# EAGLE design Secondary (EAGLE 5.12)

## Sheet 1 of 3
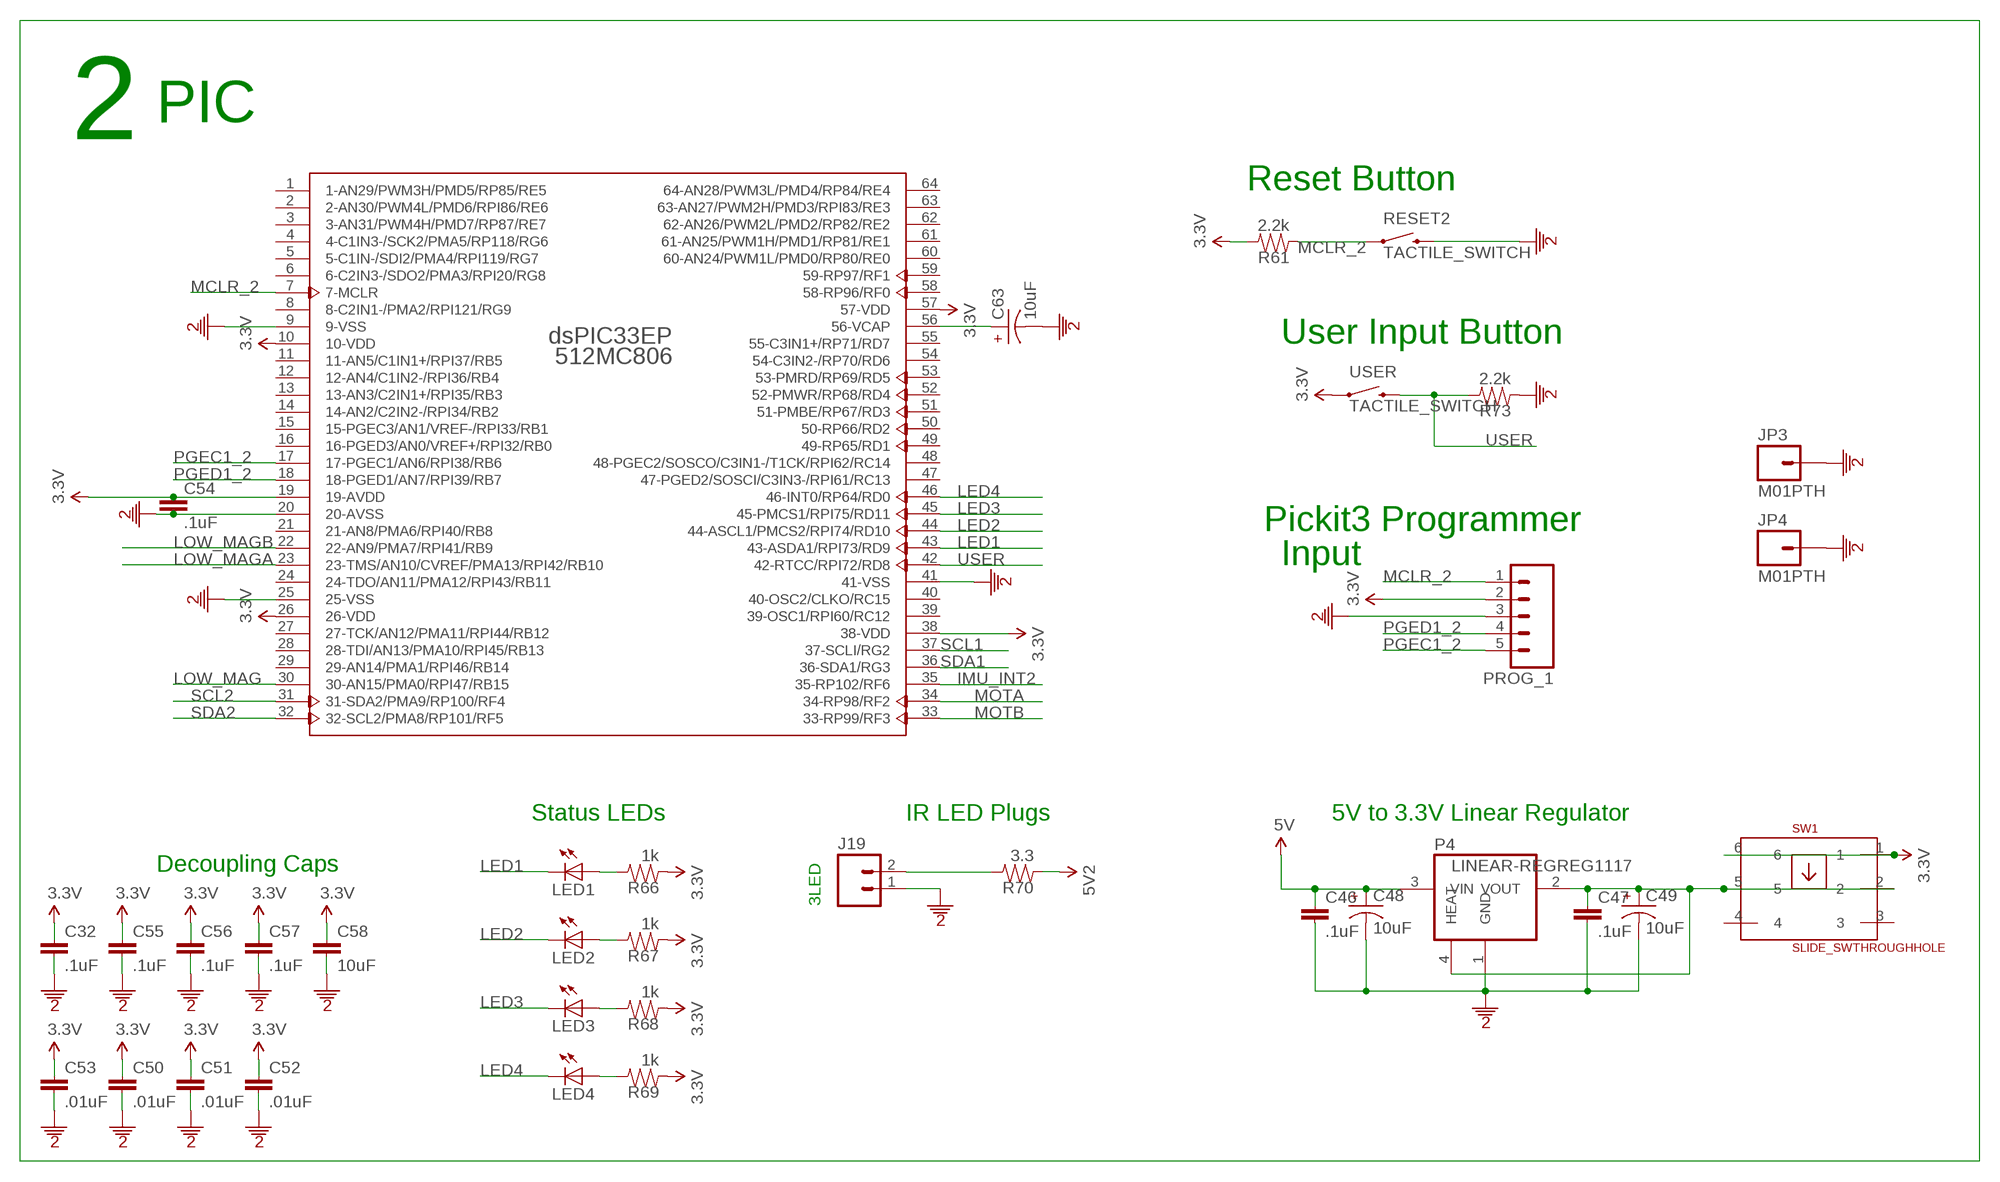
[diagram p0: schematic, sheet 1]

### Parts
C32  .1uF  CAP0603  [0603]
C46  .1uF  CAP1206  [1206]
C47  .1uF  CAP1206  [1206]
C48  10uF  CAP-POL0603  [0603-POL]
C49  10uF  CAP-POL0603  [0603-POL]
C50  .01uF  CAP0603  [0603]
C51  .01uF  CAP0603  [0603]
C52  .01uF  CAP0603  [0603]
C53  .01uF  CAP0603  [0603]
C54  .1uF  CAP0603  [0603]
C55  .1uF  CAP0603  [0603]
C56  .1uF  CAP0603  [0603]
C57  .1uF  CAP0603  [0603]
C58  10uF  CAP1206  [1206]
C63  10uF  CAP-POL0603  [0603-POL]
J19  M02JST-SH  [JST-SH-2]
JP3  M01PTH  [1X01]
JP4  M01PTH  [1X01]
LED1  LED5MM  [LED5MM]
LED2  LED5MM  [LED5MM]
LED3  LED5MM  [LED5MM]
LED4  LED5MM  [LED5MM]
P4  LINEAR-REGREG1117  LINEAR-REG1117  [SOT223]
PIC2  DSPIC33EP512MC806  [TQFP64_10X10]
PROG_1  M05PTH  [1X05]
R61  2.2k  R0603  [0603]
R66  1k  R0603  [0603]
R67  1k  R0603  [0603]
R68  1k  R0603  [0603]
R69  1k  R0603  [0603]
R70  3.3  R0603  [0603]
R73  2.2k  R0603  [0603]
RESET2  TACTILE_SWITCH  [TACTILE_SWITCH]
SW1  SLIDE_SWTHROUGHHOLE  [SLIDE_SWITCH]
USER  TACTILE_SWITCH  [TACTILE_SWITCH]

### Nets
3.3V: C32.1 C50.1 C51.1 C52.1 C53.1 C54.1 C55.1 C56.1 C57.1 C58.1 PIC2.10(10-VDD) PIC2.19(19-AVDD) PIC2.26(26-VDD) PIC2.38(38-VDD) PIC2.57(57-VDD) PROG_1.2 R61.2 R66.1 R67.1 R68.1 R69.1 SW1.1 SW1.6 USER.1 ; also sheet 2
5V2: C46.1 C48.+ P4.3(VIN) R70.1 ; supply symbol labelled 5V ; also sheet 2,3
GND2: C32.2 C46.2 C47.2 C48.- C49.- C50.2 C51.2 C52.2 C53.2 C54.2 C55.2 C56.2 C57.2 C58.2 C63.- J19.1 JP3.1 JP4.1 P4.1(GND) PIC2.9(9-VSS) PIC2.20(20-AVSS) PIC2.25(25-VSS) PIC2.41(41-VSS) PROG_1.3 R73.1 RESET2.2 ; also sheet 2,3
IMU_INT2: PIC2.35(35-RP102/RF6) ; also sheet 2
LED1: LED1.K(C) PIC2.43(43-ASDA1/RPI73/RD9)
LED2: LED2.K(C) PIC2.44(44-ASCL1/PMCS2/RPI74/RD10)
LED3: LED3.K(C) PIC2.45(45-PMCS1/RPI75/RD11)
LED4: LED4.K(C) PIC2.46(46-INT0/RP64/RD0)
LOW_MAG: PIC2.30(30-AN15/PMA0/RPI47/RB15) ; also sheet 2
LOW_MAGA: PIC2.23(23-TMS/AN10/CVREF/PMA13/RPI42/RB10) ; also sheet 2
LOW_MAGB: PIC2.22(22-AN9/PMA7/RPI41/RB9) ; also sheet 2
MCLR_2: PIC2.7(7-MCLR) PROG_1.1 R61.1 RESET2.1
MOTA: PIC2.34(34-RP98/RF2) ; also sheet 2
MOTB: PIC2.33(33-RP99/RF3) ; also sheet 2
N$104: C63.+ PIC2.56(56-VCAP)
N$108: LED1.A R66.2
N$109: LED2.A R67.2
N$110: LED3.A R68.2
N$111: LED4.A R69.2
N$112: J19.2 R70.2
PGEC1_2: PIC2.17(17-PGEC1/AN6/RPI38/RB6) PROG_1.5
PGED1_2: PIC2.18(18-PGED1/AN7/RPI39/RB7) PROG_1.4
PRE3.3: C47.1 C49.+ P4.2(VOUT) P4.4(HEAT) SW1.2 SW1.5 ; also sheet 2
SCL1: PIC2.37(37-SCLI/RG2) ; also sheet 2
SCL2: PIC2.31(31-SDA2/PMA9/RP100/RF4) ; also sheet 2
SDA1: PIC2.36(36-SDA1/RG3) ; also sheet 2
SDA2: PIC2.32(32-SCL2/PMA8/RP101/RF5) ; also sheet 2
USER: PIC2.42(42-RTCC/RPI72/RD8) R73.2 USER.2
Unconnected: PIC2.1(1-AN29/PWM3H/PMD5/RP85/RE5) PIC2.2(2-AN30/PWM4L/PMD6/RPI86/RE6) PIC2.3(3-AN31/PWM4H/PMD7/RP87/RE7) PIC2.4(4-C1IN3-/SCK2/PMA5/RP118/RG6) PIC2.5(5-C1IN-/SDI2/PMA4/RPI119/RG7) PIC2.6(6-C2IN3-/SDO2/PMA3/RPI20/RG8) PIC2.8(8-C2IN1-/PMA2/RPI121/RG9) PIC2.11(11-AN5/C1IN1+/RPI37/RB5) PIC2.12(12-AN4/C1IN2-/RPI36/RB4) PIC2.13(13-AN3/C2IN1+/RPI35/RB3) PIC2.14(14-AN2/C2IN2-/RPI34/RB2) PIC2.15(15-PGEC3/AN1/VREF-/RPI33/RB1) PIC2.16(16-PGED3/AN0/VREF+/RPI32/RB0) PIC2.21(21-AN8/PMA6/RPI40/RB8) PIC2.24(24-TDO/AN11/PMA12/RPI43/RB11) PIC2.27(27-TCK/AN12/PMA11/RPI44/RB12) PIC2.28(28-TDI/AN13/PMA10/RPI45/RB13) PIC2.29(29-AN14/PMA1/RPI46/RB14) PIC2.39(39-OSC1/RPI60/RC12) PIC2.40(40-OSC2/CLKO/RC15) PIC2.47(47-PGED2/SOSCI/C3IN3-/RPI61/RC13) PIC2.48(48-PGEC2/SOSCO/C3IN1-/T1CK/RPI62/RC14) PIC2.49(49-RP65/RD1) PIC2.50(50-RP66/RD2) PIC2.51(51-PMBE/RP67/RD3) PIC2.52(52-PMWR/RP68/RD4) PIC2.53(53-PMRD/RP69/RD5) PIC2.54(54-C3IN2-/RP70/RD6) PIC2.55(55-C3IN1+/RP71/RD7) PIC2.58(58-RP96/RF0) PIC2.59(59-RP97/RF1) PIC2.60(60-AN24/PWM1L/PMD0/RP80/RE0) PIC2.61(61-AN25/PWM1H/PMD1/RP81/RE1) PIC2.62(62-AN26/PWM2L/PMD2/RP82/RE2) PIC2.63(63-AN27/PWM2H/PMD3/RPI83/RE3) PIC2.64(64-AN28/PWM3L/PMD4/RP84/RE4) SW1.3 SW1.4

### Notes on the sheet
- 2 | PIC
- Reset Button
- User Input Button
- Pickit3 Programmer
- Input
- Status LEDs | IR LED Plugs | 5V to 3.3V Linear Regulator
- Decoupling Caps
- 3LED

## Sheet 2 of 3
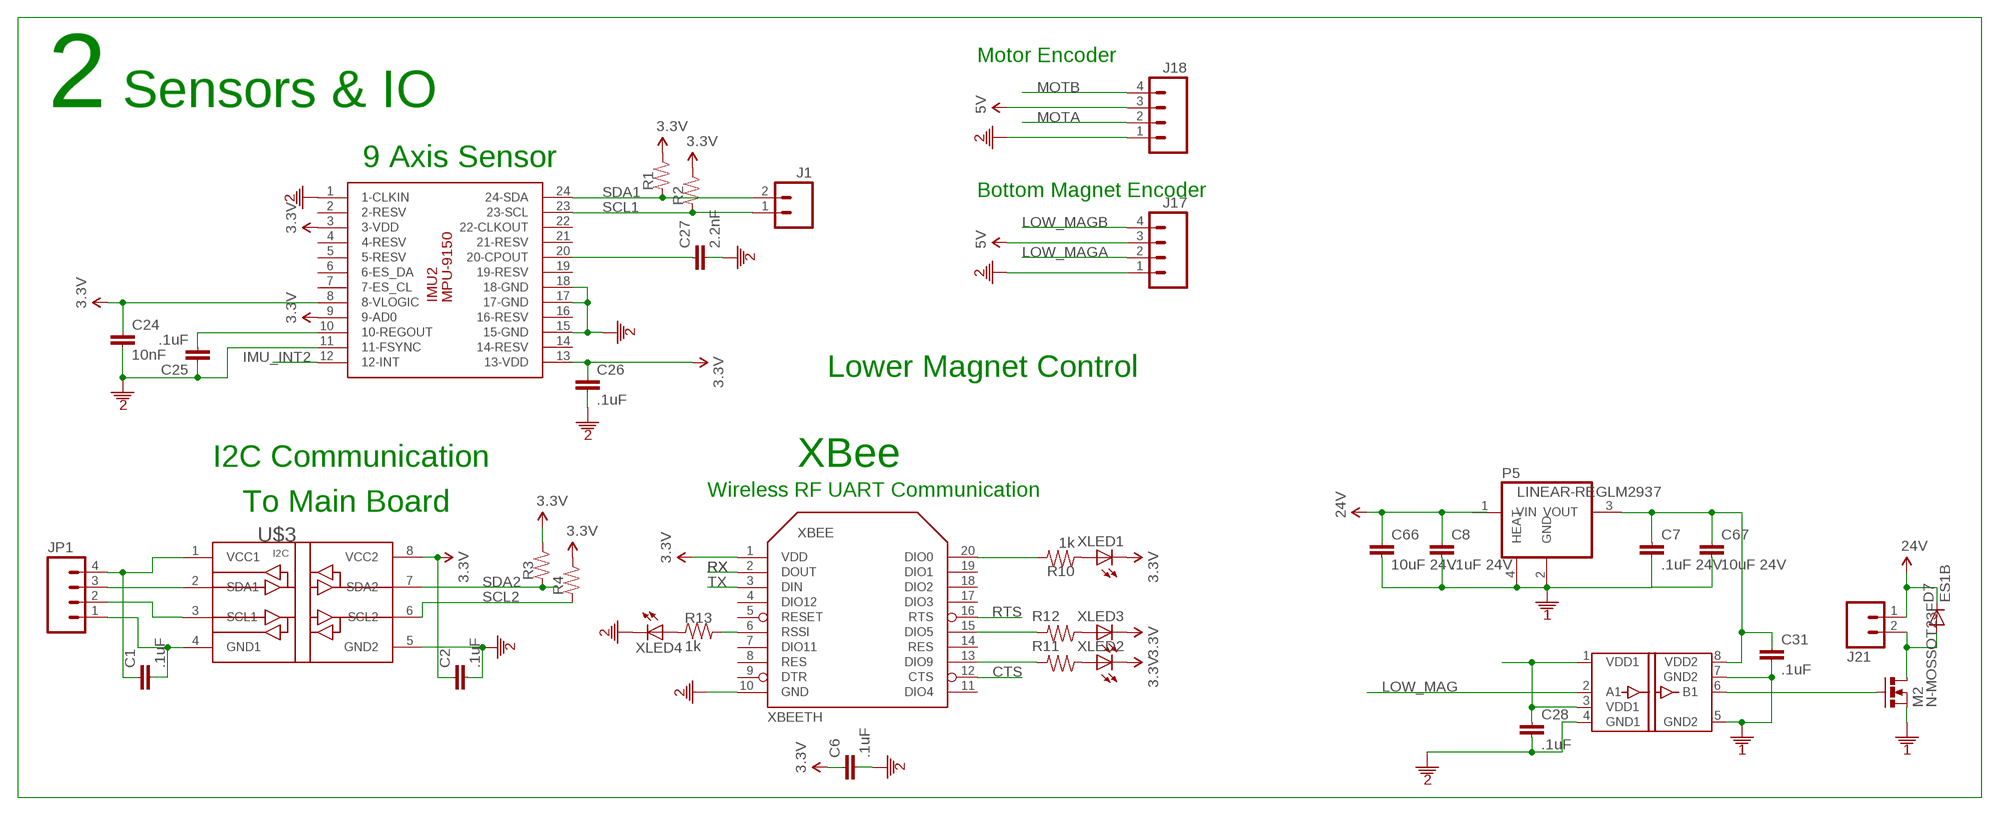
[diagram p1: schematic, sheet 2]

### Parts
C1  .1uF  CAP0603  [0603]
C2  .1uF  CAP0603  [0603]
C6  .1uF  CAP1206  [1206]
C7  .1uF 24V  CAP0603  [0603]
C8  .1uF 24V  CAP0603  [0603]
C24  10nF  CAP0603  [0603]
C25  .1uF  CAP0603  [0603]
C26  .1uF  CAP0603  [0603]
C27  2.2nF  CAP0603  [0603]
C28  .1uF  CAP0603  [0603]
C31  .1uF  CAP0603  [0603]
C66  10uF 24V  CAP1206  [1206]
C67  10uF 24V  CAP1206  [1206]
D7  ES1B  DIODESMA  [SMA-DIODE@1]
DI3  DIGITAL-ISOLATOR-1CHSOIC8-N  [SOIC8-N]
IMU2  MPU-9150  [LGA24_4X4]
J1  M02JST-PH-V  [JST-2-PH-V]
J17  M04PH-TH  [JST-4-PH-TH]
J18  M04PH-TH  [JST-4-PH-TH]
J21  M02JST-2-PH-TH  [JST-2-PH-TH]
JP1  M04PH-TH  [JST-4-PH-TH]
M2  N-MOSSOT23F  [SOT23F]
P5  LINEAR-REGLM2937  [SOT223]
R1  R0402  [0402]
R2  R0402  [0402]
R3  R0402  [0402]
R4  R0402  [0402]
R10  1k  R0603  [0603]
R11  1k  R0603  [0603]
R12  1k  R0603  [0603]
R13  1k  R0603  [0603]
U$3  ISO1540  [SOIC8]
XBEE  XBEETH  [XBEE-SILK]
XLED1  LED0603  [0603-DIODE]
XLED2  LED0603  [0603-DIODE]
XLED3  LED0603  [0603-DIODE]
XLED4  LED0603  [0603-DIODE]

### Nets
3.3V: C2.1 C6.1 C24.1 C26.1 IMU2.3(3-VDD) IMU2.8(8-VLOGIC) IMU2.9(9-AD0) IMU2.13(13-VDD) R1.2 R2.2 R3.2 R4.2 U$3.8(VCC2) XBEE.1(VDD) XLED1.CAT(C) XLED2.CAT(C) XLED3.CAT(C) ; also sheet 1
5V2: J17.3 J18.3 ; supply symbol labelled 5V ; also sheet 1,3
24V: C8.1 C66.1 D7.C J21.1 P5.1(VIN) ; also sheet 3
CTS: XBEE.12(CTS)
GND1: C7.2 C8.2 C31.2 C66.2 C67.2 DI3.5(GND2) DI3.7(GND2) M2.S P5.2(GND) P5.4(HEAT) ; also sheet 3
GND2: C2.2 C6.2 C24.2 C25.1 C26.2 C27.2 C28.2 DI3.4(GND1) IMU2.1(1-CLKIN) IMU2.11(11-FSYNC) IMU2.15(15-GND) IMU2.17(17-GND) IMU2.18(18-GND) J17.1 J18.1 U$3.5(GND2) XBEE.10(GND) XLED4.CAT(C) ; also sheet 1,3
IMU_INT2: IMU2.12(12-INT) ; also sheet 1
LOW_MAG: DI3.2(A1) ; also sheet 1
LOW_MAG_2: DI3.6(B1) M2.G
LOW_MAGA: J17.2 ; also sheet 1
LOW_MAGB: J17.4 ; also sheet 1
MOTA: J18.2 ; also sheet 1
MOTB: J18.4 ; also sheet 1
N$1: D7.A J21.2 M2.D
N$2: JP1.2 U$3.3(SCL1)
N$3: JP1.3 U$3.2(SDA1)
N$4: R11.2 XBEE.13(DIO9)
N$5: C1.1 JP1.4 U$3.1(VCC1)
N$6: C7.1 C31.1 C67.1 DI3.8(VDD2) P5.3(VOUT)
N$9: R10.2 XBEE.20(DIO0)
N$10: R10.1 XLED1.AN(A)
N$22: C27.1 IMU2.20(20-CPOUT)
N$24: C25.2 IMU2.10(10-REGOUT)
N$27: R11.1 XLED2.AN(A)
N$30: R12.2 XBEE.15(DIO5)
N$31: R12.1 XLED3.AN(A)
N$32: R13.2 XBEE.6(RSSI)
N$39: R13.1 XLED4.AN(A)
N$50: C1.2 JP1.1 U$3.4(GND1)
PRE3.3: C28.1 DI3.1(VDD1) DI3.3(VDD1) ; also sheet 1
RTS: XBEE.16(RTS)
RX: XBEE.2(DOUT)
SCL1: IMU2.23(23-SCL) J1.1 R2.1 ; also sheet 1
SCL2: R4.1 U$3.6(SCL2) ; also sheet 1
SDA1: IMU2.24(24-SDA) J1.2 R1.1 ; also sheet 1
SDA2: R3.1 U$3.7(SDA2) ; also sheet 1
TX: XBEE.3(DIN)
Unconnected: IMU2.2(2-RESV) IMU2.4(4-RESV) IMU2.5(5-RESV) IMU2.6(6-ES_DA) IMU2.7(7-ES_CL) IMU2.14(14-RESV) IMU2.16(16-RESV) IMU2.19(19-RESV) IMU2.21(21-RESV) IMU2.22(22-CLKOUT) XBEE.4(DIO12) XBEE.5(RESET) XBEE.7(DIO11) XBEE.8(RES) XBEE.9(DTR) XBEE.11(DIO4) XBEE.14(RES) XBEE.17(DIO3) XBEE.18(DIO2) XBEE.19(DIO1)

### Notes on the sheet
- Motor Encoder
- 2 | Sensors & IO
- 9 Axis Sensor
- Bottom Magnet Encoder
- Lower Magnet Control
- I2C Communication | XBee
- Wireless RF UART Communication
- To Main Board

## Sheet 3 of 3
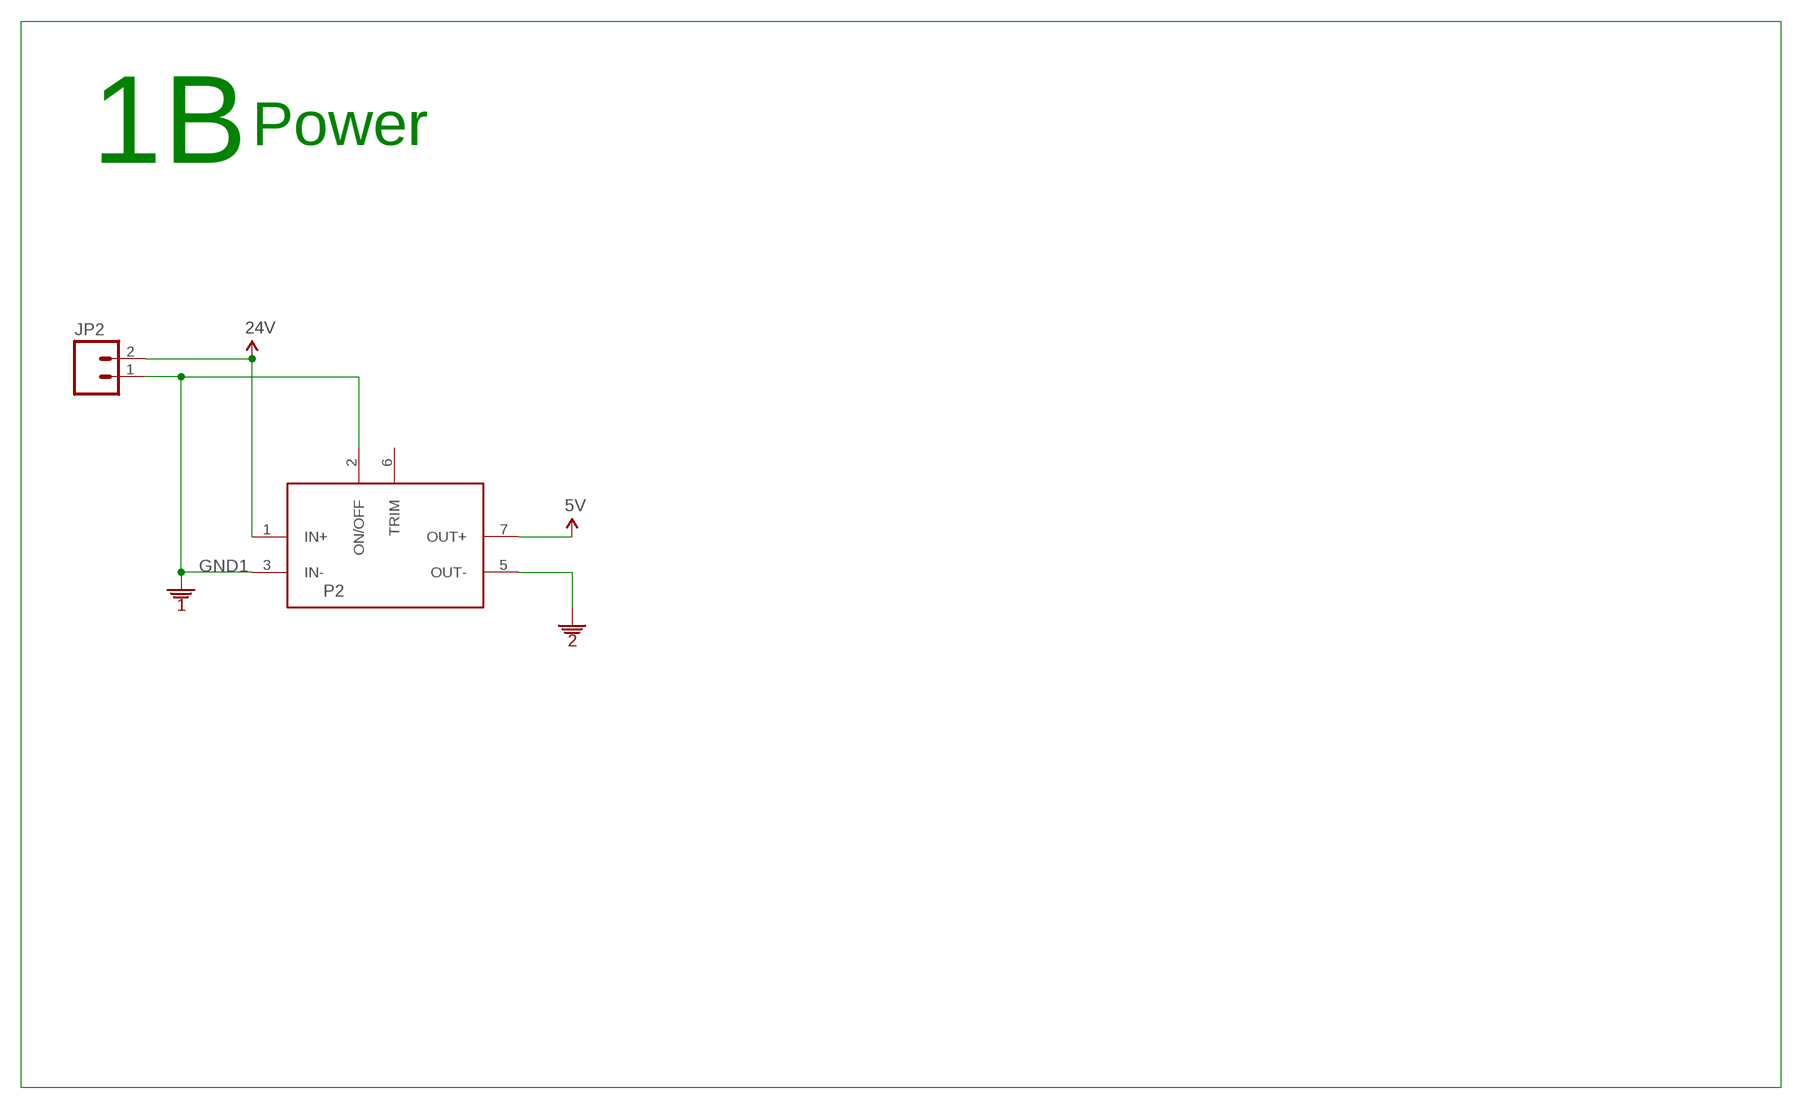
[diagram p2: schematic, sheet 3]

### Parts
JP2  M02JST-PH-TH  [JST-2-PH-TH]
P2  CC10-2405SF-E  DC-DC-CONVERTER1.2A  [CC6-2405SF-E]

### Nets
5V2: P2.7(OUT+) ; supply symbol labelled 5V ; also sheet 1,2
24V: JP2.2 P2.1(IN+) ; also sheet 2
GND1: JP2.1 P2.2(ON/OFF) P2.3(IN-) ; also sheet 2
GND2: P2.5(OUT-) ; also sheet 1,2
Unconnected: P2.6(TRIM)

### Notes on the sheet
- 1 | B | Power

## Library data of the parts
C1 C2 C7 C8 C24-C28 C31 C32 C46 C47 C50-C58 C66 C67 = Gibbot v4:CAP: Capacitor Standard 0603 ceramic capacitor, and 0.1" leaded capacitor.
C6 = GibbotV5:CAP: Capacitor Standard 0603 ceramic capacitor, and 0.1" leaded capacitor.
C48 C49 C63 = Gibbot v4:CAP-POL: CAPACITOR, American symbol
D7 = Gibbot v4:DIODE: Diode These are standard reverse protection diodes and small signal diodes. SMA package can handle up to about 1A. SOD-323 can handle about 200mA. What the SOD-323 package when ordering, there are some mfgs out there that are 5-pin packages.
DI3 = Gibbot v4:DIGITAL-ISOLATOR-1CH
IMU2 = Gibbot v4:MPU-9150
J1 JP2 = GibbotV5:M02: Header 2 Standard 2-pin 0.1" header. Use with straight break away headers (SKU : PRT-00116), right angle break away headers (PRT-00553), swiss pins (PRT-00743), machine pins (PRT-00117), and female headers (PRT-00115). Molex polarized connector foot print use with SKU : PRT-08233 with associated crimp pins and housings.
J17 = Gibbot v4:M04: Header 4 Standard 4-pin 0.1" header. Use with straight break away headers (SKU : PRT-00116), right angle break away headers (PRT-00553), swiss pins (PRT-00743), machine pins (PRT-00117), and female headers (PRT-00115). Molex polarized connector foot print use with SKU : PRT-08231 with associated crimp pins and housings. 1MM SMD Version SKU: PRT-10208
J18 JP1 = GibbotV5:M04: Header 4 Standard 4-pin 0.1" header. Use with straight break away headers (SKU : PRT-00116), right angle break away headers (PRT-00553), swiss pins (PRT-00743), machine pins (PRT-00117), and female headers (PRT-00115). Molex polarized connector foot print use with SKU : PRT-08231 with associated crimp pins and housings. 1MM SMD Version SKU: PRT-10208
J19 J21 = Gibbot v4:M02: Header 2 Standard 2-pin 0.1" header. Use with straight break away headers (SKU : PRT-00116), right angle break away headers (PRT-00553), swiss pins (PRT-00743), machine pins (PRT-00117), and female headers (PRT-00115). Molex polarized connector foot print use with SKU : PRT-08233 with associated crimp pins and housings.
JP3 JP4 = GibbotV5:M01: Header 1 Standard 1-pin 0.1" header. Use with straight break away headers (SKU : PRT-00116), right angle break away headers (PRT-00553), swiss pins (PRT-00743), machine pins (PRT-00117), and female headers (PRT-00115).
LED1-LED4 XLED1-XLED4 = GibbotV5:LED: LEDs Standard schematic elements and footprints for 5mm, 3mm, 1206, and 0603 sized LEDs. 5mm - Spark Fun Electronics SKU : COM-00529 (and others)
M2 = Gibbot v4:N-MOS
P2 = GibbotV5:DC-DC-CONVERTER
P4 P5 = Gibbot v4:LINEAR-REG
PIC2 = Gibbot v4:DSPIC33EP512MC806
PROG_1 = Gibbot v4:M05: Header 5 Standard 5-pin 0.1" header. Use with straight break away headers (SKU : PRT-00116), right angle break away headers (PRT-00553), swiss pins (PRT-00743), machine pins (PRT-00117), and female headers (PRT-00115). Molex polarized connector foot print use with SKU : PRT-08230 with associated crimp pins and housings.
R1-R4 R10-R13 = GibbotV5:R: RESISTOR, American symbol
R61 R66-R70 R73 = Gibbot v4:R: RESISTOR, American symbol
RESET2 USER = Gibbot v4:TACTILE_SWITCH
SW1 = Gibbot:SLIDE_SW
U$3 = GibbotV5:ISO1540
XBEE = GibbotV5:XBEE

## Board
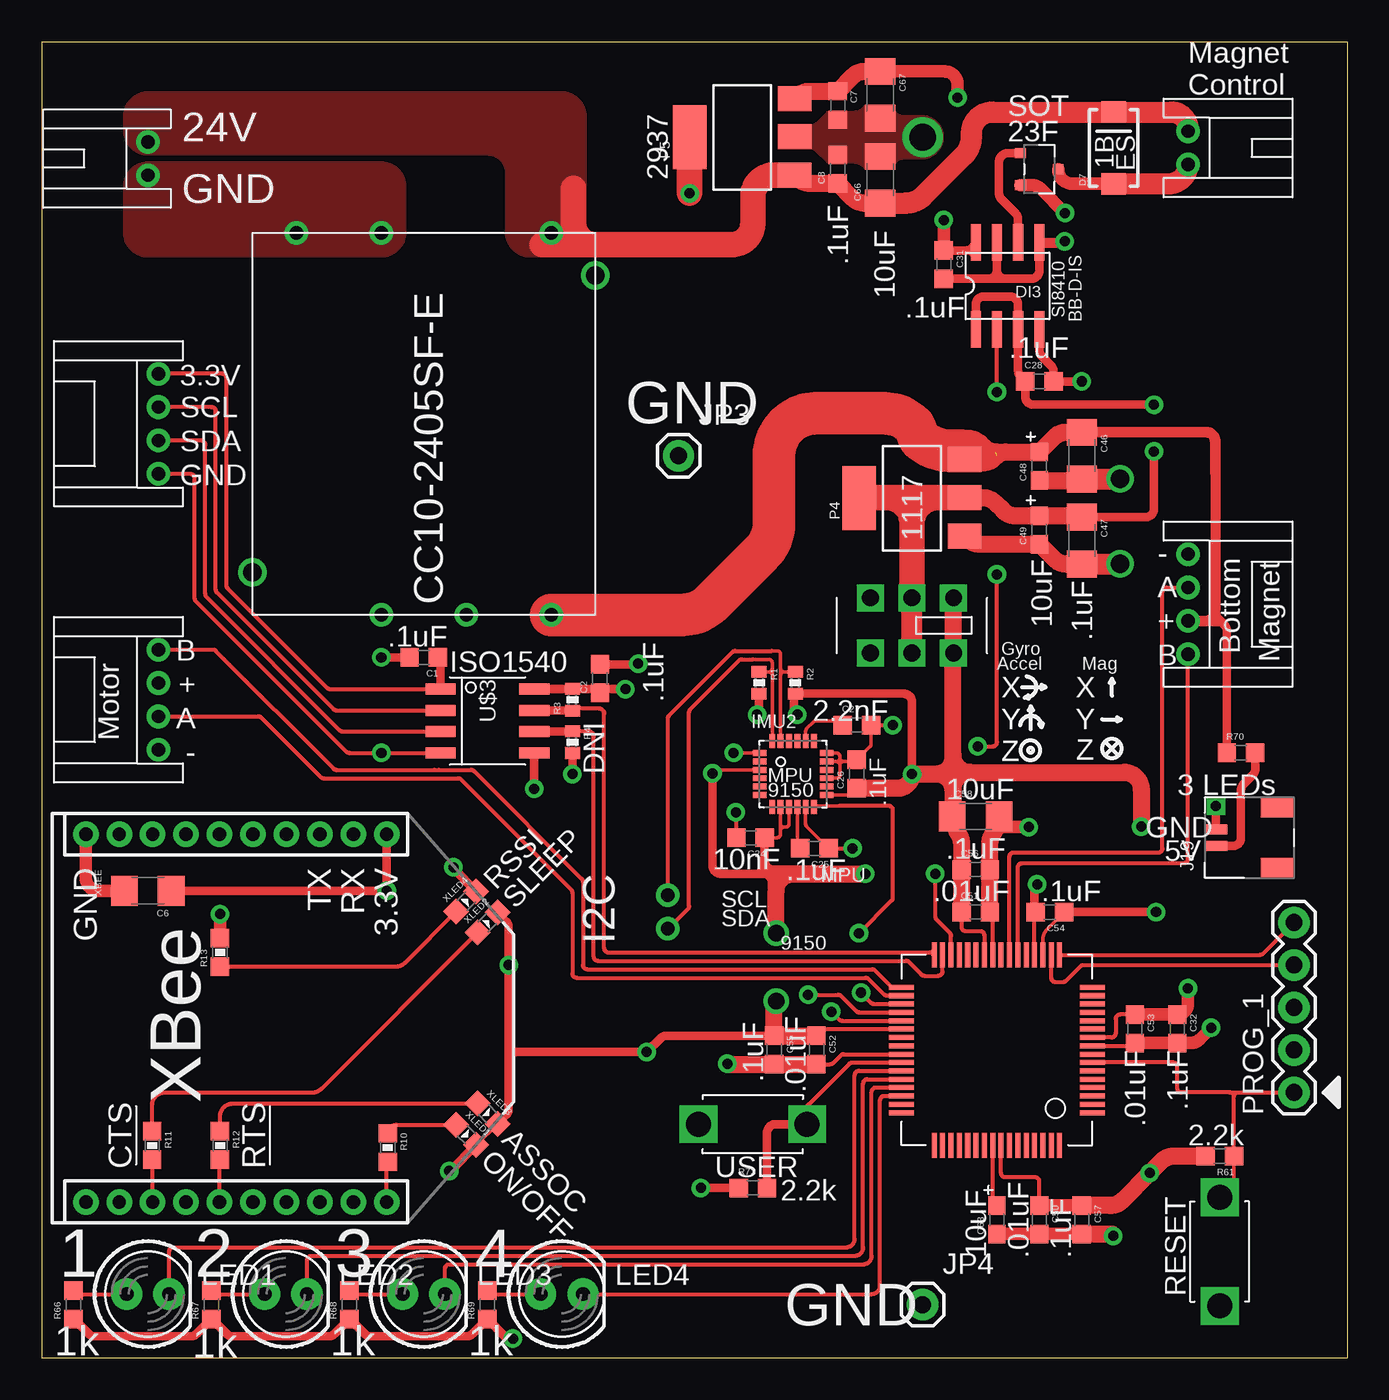
[diagram p3: board, top side]
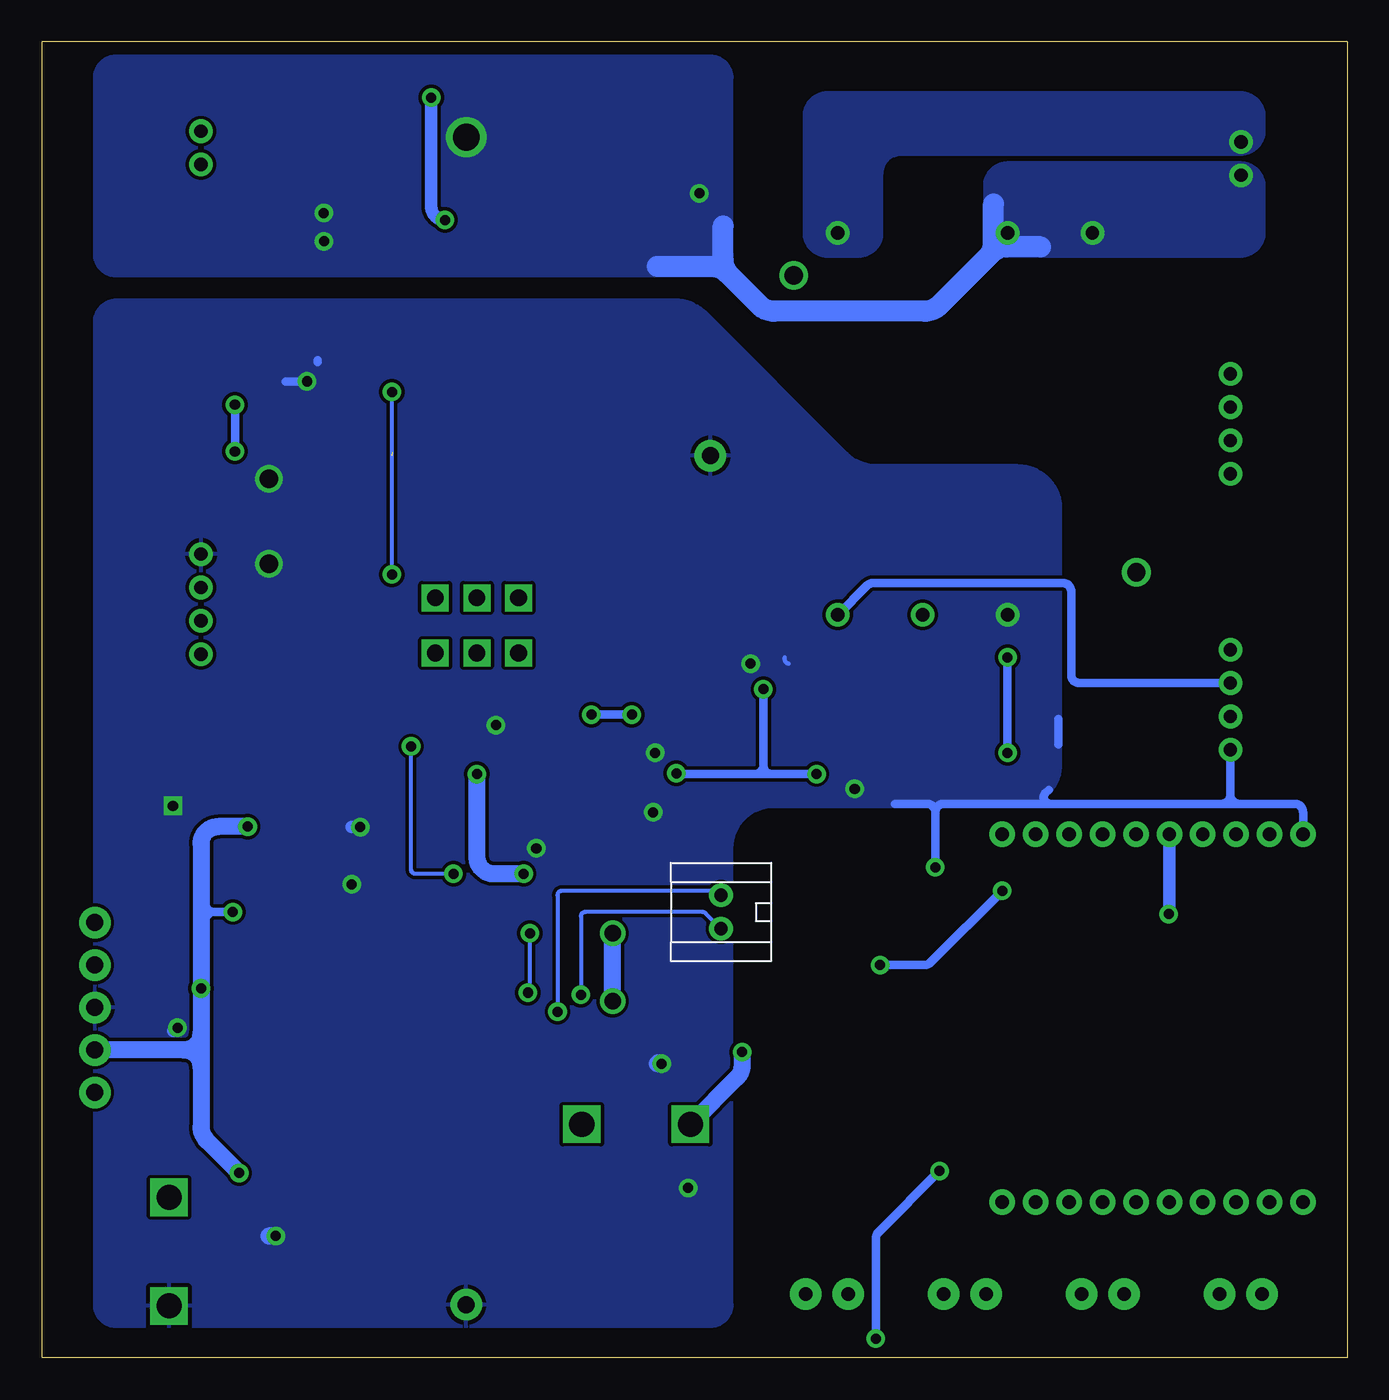
[diagram p4: board, bottom side, seen from below]

Size 78.11 x 78.74 mm. Coordinates in mm from the lower left corner, seen from the top.
Outline: 0,0 78.11,0 78.11,78.74 0,78.74 0,0
Copper layers (1*16): Top 0.035mm / dielectric 1.5mm / Bottom 0.035mm
Design rules "Andrew *": minimum track width 8mil, minimum drill 20mil, track to track 8mil, track to pad 8mil, pad to pad 2mil, via to via 8mil, smd to smd 8mil, copper to edge 10mil, drill to drill 8mil, minimum pad ring 12mil, minimum via ring 10mil, stop-mask expansion 4mil, vias tented up to drill 25mil, thermal gap 10mil

### Footprints (pad centres in the part's own frame; a part is rotated, then mirrored left to right if it is on the bottom)
0603 = smd 1.1 x 1.1: 1 -0.85,0; 2 0.85,0
1206 = smd 1.6 x 1.8: 1 -1.4,0; 2 1.4,0
0603-POL = smd 1.1 x 1: + 0.85,0; - -0.85,0
SMA-DIODE@1 = smd 1.27 x 1.47: A -2.15,0; C 2.15,0
SOIC8-N = smd 2.2 x 0.6: 1 -2.6,1.905; 2 -2.6,0.635; 3 -2.6,-0.635; 4 -2.6,-1.905; 5 2.6,-1.905; 6 2.6,-0.635; 7 2.6,0.635; 8 2.6,1.905
LGA24_4X4 = smd 0.8 x 0.35: 1 -2,1.25; 2 -2,0.75; 3 -2,0.25; 4 -2,-0.25; 5 -2,-0.75; 6 -2,-1.25; 13 2,-1.25; 14 2,-0.75; 15 2,-0.25; 16 2,0.25; 17 2,0.75; 18 2,1.25 | smd 0.35 x 0.85: 7 -1.25,-1.975; 8 -0.75,-1.975; 9 -0.25,-1.975; 10 0.25,-1.975; 11 0.75,-1.975; 12 1.25,-1.975; 19 1.25,1.975; 20 0.75,1.975; 21 0.25,1.975; 22 -0.25,1.975; 23 -0.75,1.975; 24 -1.25,1.975
JST-2-PH-V = drill 0.8 round: 1 -1,0; 2 1,0
JST-4-PH-TH = drill 0.8 round: 1 -3,-6.35; 2 -1,-6.35; 3 1,-6.35; 4 3,-6.35
JST-SH-2 = smd 0.6 x 1.35: 1 0.5,4.675; 2 -0.5,4.675 | smd 1.2 x 2: P$6 -1.8,1; P$7 1.8,1
JST-2-PH-TH = drill 0.8 round: 1 -1,-6.35; 2 1,-6.35
1X01 = drill 1.016 pad 1.88 round: 1 0,0
LED5MM = drill 0.813 pad 1.88 round: A -1.27,0; K 1.27,0
SOT23F = smd 0.6 x 0.65: D 0,1.125; G -0.95,-1.125; S 0.95,-1.125
CC6-2405SF-E = drill 0.8 round: 1 -11.43,7.62; 2 -11.43,-2.54; 3 -11.43,-7.62; 5 11.43,-2.54; 6 11.43,2.54; 7 11.43,7.62 | drill 1.1 round: P$9 8.89,-10.25; P$10 -8.89,10.25
SOT223 = smd 1.499 x 2.007: 1 -2.261,-3.15; 2 0.025,-3.15; 3 2.311,-3.15 | smd 3.81 x 2.007: 4 0,3.15
TQFP64_10X10 = smd 1.5 x 0.3: 1 -5.7,3.75; 2 -5.7,3.25; 3 -5.7,2.75; 4 -5.7,2.25; 5 -5.7,1.75; 6 -5.7,1.25; 7 -5.7,0.75; 8 -5.7,0.25; 9 -5.7,-0.25; 10 -5.7,-0.75; 11 -5.7,-1.25; 12 -5.7,-1.75; 13 -5.7,-2.25; 14 -5.7,-2.75; 15 -5.7,-3.25; 16 -5.7,-3.75; 33 5.7,-3.75; 34 5.7,-3.25; 35 5.7,-2.75; 36 5.7,-2.25; 37 5.7,-1.75; 38 5.7,-1.25; 39 5.7,-0.75; 40 5.7,-0.25; 41 5.7,0.25; 42 5.7,0.75; 43 5.7,1.25; 44 5.7,1.75; 45 5.7,2.25; 46 5.7,2.75; 47 5.7,3.25; 48 5.7,3.75 | smd 0.3 x 1.5: 17 -3.75,-5.7; 18 -3.25,-5.7; 19 -2.75,-5.7; 20 -2.25,-5.7; 21 -1.75,-5.7; 22 -1.25,-5.7; 23 -0.75,-5.7; 24 -0.25,-5.7; 25 0.25,-5.7; 26 0.75,-5.7; 27 1.25,-5.7; 28 1.75,-5.7; 29 2.25,-5.7; 30 2.75,-5.7; 31 3.25,-5.7; 32 3.75,-5.7; 49 3.75,5.7; 50 3.25,5.7; 51 2.75,5.7; 52 2.25,5.7; 53 1.75,5.7; 54 1.25,5.7; 55 0.75,5.7; 56 0.25,5.7; 57 -0.25,5.7; 58 -0.75,5.7; 59 -1.25,5.7; 60 -1.75,5.7; 61 -2.25,5.7; 62 -2.75,5.7; 63 -3.25,5.7; 64 -3.75,5.7
1X05 = drill 1.016 pad 1.88 round: 1 0,0; 2 2.54,0; 3 5.08,0; 4 7.62,0; 5 10.16,0
0402 = smd 0.7 x 0.9: 1 -0.65,0; 2 0.65,0
TACTILE_SWITCH = drill 1.5 square: 1 -3.25,0; 2 3.25,0
SLIDE_SWITCH = drill 1 square: 1 -2.489,1.651; 2 0,1.651; 3 2.489,1.651; 4 2.489,-1.651; 5 0,-1.651; 6 -2.489,-1.651
SOIC8 = smd 0.65 x 1.8: 1 -1.905,-2.8; 2 -0.635,-2.8; 3 0.635,-2.8; 4 1.905,-2.8; 5 1.905,2.8; 6 0.635,2.8; 7 -0.635,2.8; 8 -1.905,2.8
XBEE-SILK = drill 0.8 pad 1.524 round: 1 -11,20; 2 -11,18; 3 -11,16; 4 -11,14; 5 -11,12; 6 -11,10; 7 -11,8; 8 -11,6; 9 -11,4; 10 -11,2; 11 11,2; 12 11,4; 13 11,6; 14 11,8; 15 11,10; 16 11,12; 17 11,14; 18 11,16; 19 11,18; 20 11,20
0603-DIODE = smd 1.1 x 1.1: AN -0.85,0; CAT 0.85,0

### Placement (x,y rotation side)
C1  22.86,41.91 180 top
C2  33.4,40.64 90 top
C6  6.35,27.94 180 top
C7  47.62,74.93 270 top
C8  47.62,71.12 90 top
C24  42.42,31.11 180 top
C25  46.23,30.48 180 top
C26  48.77,34.92 90 top
C27  48.77,37.85 0 top
C28  59.69,58.42 0 top
C31  53.98,65.41 270 top
C32  67.94,19.68 270 top
C46  62.23,53.98 270 top
C47  62.23,48.9 270 top
C48  59.69,53.34 90 top
C49  59.69,49.53 90 top
C50  59.69,8.26 270 top
C51  55.88,26.67 0 top
C52  46.35,18.41 270 top
C53  65.41,19.68 270 top
C54  60.33,26.67 180 top
C55  43.81,18.41 270 top
C56  55.88,29.21 0 top
C57  62.23,8.26 270 top
C58  55.88,32.38 0 top
C63  57.15,8.26 90 top
C66  50.16,70.48 90 top
C67  50.16,75.56 270 top
D7  64.14,72.39 90 top
DI3  57.78,64.14 90 top
IMU2  44.96,34.92 0 top
J1  37.47,26.67 270 bottom
J17  74.93,45.09 270 top
J18  0.64,39.37 90 top
J19  74.93,31.11 90 top
J21  74.93,72.39 270 top
JP1  0.64,55.88 90 top
JP2  0,71.75 90 top
JP3  38.1,53.98 0 top
JP4  52.7,3.17 0 top
LED1  6.35,3.81 0 top
LED2  14.61,3.81 0 top
LED3  22.86,3.81 0 top
LED4  31.11,3.81 0 top
M2  59.69,71.12 270 top
P2  22.86,55.88 270 top
P4  52.07,51.44 90 top
P5  41.91,73.03 90 top
PIC2  57.15,18.41 180 top
PROG_1  74.93,15.88 90 top
R1  42.93,40.39 270 top
R2  45.09,40.39 270 top
R3  31.75,39.37 90 top
R4  31.75,36.83 270 top
R10  20.7,12.57 270 top
R11  6.6,12.7 270 top
R12  10.67,12.7 270 top
R13  10.67,24.26 90 top
R61  70.48,12.06 180 top
R66  1.91,3.17 90 top
R67  10.16,3.17 90 top
R68  18.41,3.17 90 top
R69  26.67,3.17 90 top
R70  71.75,36.2 0 top
R73  42.55,10.16 0 top
RESET2  70.48,6.35 270 top
SW1  52.07,43.81 180 top
U$3  26.67,38.1 270 top
USER  42.55,13.97 0 top
XBEE  0.64,20.32 270 top
XLED1  25.4,13.34 315 top
XLED2  26.67,26.04 45 top
XLED3  26.67,14.61 315 top
XLED4  25.4,27.3 45 top

### Tracks (layer width: path | path; a pad name or v marks a point on that pad's centre or on a via)
3.3V  (via drill 0.6, 1)
  Top 0.203: PIC2.19 59.9,24.97 arc-45 60.2,25.69 C54.1 | IMU2.13 48.28,33.67 arc45 48.43,33.73 | C24.1 43.99,31.11 arc90 44.2,31.32 44.2,31.95 | IMU2.9 44.71,31.95 arc-90 44.51,31.75 44.4,31.75 | 44.4,31.75 arc90 44.2,31.55 | 44.2,31.95 arc90 44.4,31.75 | IMU2.8 arc90 44.2,32.94 44.2,31.95 | 40.13,34.8 v40.13,34.97 arc-90 40.34,35.17 IMU2.3
  Top 0.254: PIC2.26 56.4,25.27 arc90 56.15,25.53 55.28,25.53 arc-90 55.03,25.78 C51.1 | PIC2.10 64.01,19.16 arc90 64.26,19.42 64.26,20.28 arc-90 64.52,20.54 C53.1 | PIC2.57 57.4,11.05 arc90 57.65,10.79 59.44,10.79 arc-90 59.69,10.54 C50.1 | PIC2.38 46.61,19.66 arc90 46.35,19.41 C52.1 | XLED1.CAT XLED3.CAT | C26.1 arc-90 48.43,33.73 | 31.79,40.01 arc-45 R3.2 | R3.2 arc-45 31.71,40.01 | R3.2 arc90 R3.2 | 40.13,32.38 v40.13,34.97
  Top 0.508: v66.67,26.67 C54.1 | v45.21,38.48 arc90 45.02,38.8 45.02,39.74 R2.2 51.56,39.74 arc-90 52.07,39.23 v52.07,34.92 | v42.8,38.48 arc-90 42.93,38.86 R1.2 | 40.13,34.8 40.13,32.38 40.13,29.46 arc90 40.64,28.96 42.75,28.96 | 54.27,33.61 54.48,33.61 arc90 54.52,33.66 | R66.1 2.81,1.42 arc45 3.17,1.27 8.89,1.27 arc45 9.25,1.42 R67.1 11.07,1.42 arc45 11.43,1.27 17.15,1.27 arc45 17.51,1.42 R68.1 19.32,1.42 arc45 19.68,1.27 25.41,1.27 arc45 25.76,1.42 R69.1 27.7,1.29 arc45 28.06,1.14 v28.19,1.14 | v24.38,11.18 arc45 24.48,11.22 XLED1.CAT | XLED3.CAT 27.79,14.52 arc45 27.94,14.88 27.94,18.8 | XLED2.CAT 27.79,26.12 arc-45 27.94,25.76 v27.94,23.5 27.94,21.59 27.94,18.8 | 43.51,28.96 arc45 43.81,29.08 arc-45 44.12,29.21 45.72,29.21 | 43.18,28.96 42.75,28.96 | 43.18,28.96 43.51,28.96 | 43.26,29.72 43.26,29.46 arc-90 42.75,28.96 | 43.26,29.72 arc90 43.76,29.21 43.81,29.21 | 43.81,29.21 46.71,29.21 | 43.26,29.72 43.26,31.1 arc-90 C24.1 | 43.18,28.96 arc-90 43.69,28.45 43.69,27.94 | 43.69,27.94 43.69,27.3 | 43.51,28.96 43.56,28.96 arc90 43.81,29.21 | 43.94,27.94 43.69,27.94 | C55.1 37.38,19.27 arc45 37.02,19.12 v36.2,18.29 28.45,18.29 | 28.45,18.29 arc90 27.94,17.78 | 27.94,18.8 arc90 28.45,18.29 | v34.92,40.01 33.62,40.01 arc90 C2.1 arc90 33.19,40.01 31.79,40.01 | U$3.8 31.73,40.01 arc90 R3.2 | v31.75,34.92 R4.2 | C6.1 v20.64,27.94 XBEE.1
  Top 0.762: C53.1 C32.1 arc90 68.58,21.17 v68.58,22.1 | C57.1 C50.1
  Top 1.016: SW1.6 SW1.1 arc45 54.52,42.07 54.52,36.04 | 54.52,35.94 54.52,34.01 | 54.52,34.01 arc-90 55.54,35.03 | v65.79,31.77 65.79,34.01 arc90 64.77,35.03 55.54,35.03 | 54.52,36.04 arc90 55.54,35.03 | R61.2 67.73,12.06 arc45 67.01,11.77 v66.29,11.05 64.65,9.4 arc-45 63.93,9.11 C57.1 | C52.1 C55.1 43.81,21.03 arc-45 v43.94,21.34 | 54.52,33.91 54.52,34.01 | C51.1 C56.1 55.03,30.78 arc45 54.73,31.5 C58.1 arc45 54.52,31.85 54.52,33.66 54.52,33.91 | 54.52,35.94 54.52,36.04 | 53.51,34.92 arc90 54.52,35.94 | 44.96,28.96 44.74,28.96 | C26.1 51.22,34.08 arc90 v52.07,34.92 53.51,34.92 | 53.51,34.92 arc-90 54.52,33.91 | v43.94,25.4 43.94,27.94 arc-90 44.96,28.96 | 44.96,28.96 v49.28,28.96
  Bottom 0.254: v40.13,34.97 arc-90 40.09,34.92
  Bottom 0.508: 67.82,26.67 arc90 68.33,27.18 arc90 68.58,27.43 68.58,30.76 | 67.82,26.67 v66.67,26.67 | 67.82,26.67 arc-90 68.33,26.16 | v45.21,38.48 v42.8,38.48 | v24.38,11.18 28.05,7.51 arc-45 28.19,7.16 v28.19,1.14 | 40.09,34.92 35.43,34.92 | 35.43,34.92 arc-90 34.92,35.43 | 34.92,35.43 v34.92,40.01 | 34.92,35.43 arc-90 34.42,34.92 | 35.43,34.92 v31.75,34.92 | v20.64,27.94 24.93,23.64 arc45 25.29,23.5 v27.94,23.5
  Bottom 1.016: 68.58,19.43 arc90 69.6,18.41 | 69.6,18.41 arc90 68.58,17.4 | 68.58,19.43 68.58,13.81 arc-45 68.28,13.09 arc-45 68.25,13 v66.29,11.05 | 68.58,19.43 v68.58,22.1 68.58,30.76 arc90 67.56,31.77 v65.79,31.77 | 69.6,18.41 PROG_1.2 | v52.07,34.92 52.07,29.97 arc-90 51.05,28.96 v49.28,28.96 | USER.1 36.49,16.77 arc-45 36.2,17.49 v36.2,18.29 | v43.94,21.34 v43.94,25.4
5V2  (1 unrouted)
  Top 0.254: J17.3 68.58,44.02 | 70.26,44.61 arc-90 70.21,44.66 70.21,44.7
  Top 0.508: R70.1 70.91,43.51 arc90 70.4,44.02 68.58,44.02 68.53,44.02 | 70.26,47.04 70.26,44.61 arc45 70.46,44.17 70.76,43.87
  Top 0.61: J17.3 69.6,44.09 arc90 70.21,44.7 70.21,52.95
  Top 0.635: 70.21,52.95 70.21,54.87 arc90 69.7,55.38 C46.1
  Top 1.016: 55.41,53.55 56.31,53.55 arc45 57.03,53.85 57.15,53.98 arc-45 57.67,54.19 C48.+ 60.58,55.08 arc-45 61.3,55.38 C46.1 | 54.3,54.27 55.19,53.81 arc-45 P4.3 | 54.38,55.02 55.16,55.02 arc-45 56.13,54.74 56.38,54.49 arc45 57.1,54.19 59.3,54.19
  Top 1.118: P4.3 arc90 55.41,53.55
  Top 2.54: P2.7 38.32,44.45 arc45 40.11,45.19 43.07,48.15 arc45 43.81,49.95 43.81,53.98 arc-90 46.35,56.52 50.38,56.52 arc-45 52.18,55.77 52.51,55.01 arc45 54.3,54.27
  Bottom 0.508: J18.3 16,40.37 arc90 16.51,40.88 16.51,45.85 arc-90 17.02,46.35 28.36,46.35 arc-45 28.72,46.21 P2.7
24V
  Top 0.254: J21.1 68.58,73.5 arc-45 68.59,73.53
  Top 1.016: P5.1 45.26,70.57 arc45 45.98,70.27 C8.1 48.51,69.38 arc45 49.23,69.08 C66.1
  Top 1.27: 68.59,73.53 arc90 67.58,74.54 D7.C 56.9,74.54 arc90 55.63,73.27 55.63,73.02 arc-45 55.18,71.94 52.77,69.53 arc-45 51.69,69.08 C66.1
  Top 1.524: P5.1 43.81,70.76 arc90 42.55,69.49 42.55,67.87 arc-90 41.27,66.6 29.92,66.6 | 33.1,66.6 arc-90 31.83,67.87 31.83,69.98
  pour Bottom (no thermals): 5.08,74.3 arc-90 6.35,75.56 31.11,75.56 arc-90 32.38,74.3 32.38,67.31 arc-90 31.11,66.04 29.21,66.04 arc-90 27.94,67.31 27.94,70.87 arc90 26.67,72.14 6.35,72.14 arc-90 5.08,73.41
  pour Top (no thermals): 5.08,74.3 arc-90 6.35,75.56 31.11,75.56 arc-90 32.38,74.3 32.38,67.31 arc-90 31.11,66.04 29.21,66.04 arc-90 27.94,67.31 27.94,70.87 arc90 26.67,72.14 6.35,72.14 arc-90 5.08,73.41
GND1  (via drill 0.6, 1.6)
  Top 0.508: C31.2 56.64,64.56 | 56.64,64.56 arc90 57.15,65.06 | DI3.5 59.69,65.06 arc-90 59.18,64.56 57.66,64.56 | 56.64,64.56 57.66,64.56 | 57.15,65.06 DI3.7 | 57.15,65.06 arc90 57.66,64.56
  Top 0.61: DI3.5 61.05,66.73 arc45 v61.21,66.8
  Top 0.762: 61.05,66.73 arc45 v61.21,66.8 | M2.S 59.23,70.17 arc-45 59.77,69.95 v61.23,68.49
  Top 1.524: v38.76,69.67 P5.4
  Bottom 0.762: v61.21,66.8 61.34,66.67
  Bottom 1.27: 41.27,65.29 38,65.29 arc45 37.11,64.92 | 21.53,65.85 arc-45 21.16,66.74 21.16,69.05 | 37.34,67.73 37.34,65.68 arc-45 36.97,64.78 35.17,62.98 arc-45 34.27,62.61 25.29,62.61 arc-45 24.39,62.98 21.28,66.1 arc45 20.38,66.47 18.33,66.47
  other vias: 52.7,73.03
  pour Bottom: 36.83,66.04 36.83,76.58 arc-90 38.1,77.85 73.66,77.85 arc-90 74.93,76.58 74.93,66.04 arc-90 73.66,64.77 38.1,64.77 arc-90
  pour Top (no thermals): 44.2,73.66 45.97,73.66 arc45 46.41,73.85 47.07,74.5 48.68,74.5 arc45 49.13,74.68 49.28,74.83 50.93,74.83 50.93,71.22 49.28,71.22 49.13,71.37 arc45 48.68,71.55 47.07,71.55 46.36,72.25 arc45 45.91,72.44 44.2,72.44
  pour Top (no thermals): 50.93,74.83 arc90 51.51,74.24 52.65,74.24 arc-90 53.85,73.05 arc-90 52.6,71.81 51.51,71.81 arc90 50.93,71.22 50.16,71.22 50.16,74.83
  pour Top (no thermals): 5.08,67.31 5.08,70.1 arc-90 6.35,71.37 12.06,71.37 13.46,71.37 20.32,71.37 arc-90 21.59,70.1 21.59,67.31 arc-90 20.32,66.04 6.35,66.04 arc-90
  pour Bottom (no thermals): 5.08,67.31 5.08,70.1 arc-90 6.35,71.37 12.06,71.37 12.32,71.37 20.32,71.37 arc-90 21.59,70.1 21.59,67.31 arc-90 20.32,66.04 6.35,66.04 arc-90
GND2  (via drill 0.6, 1.1)
  Top 0.203: IMU2.11 45.71,31.93 arc45 45.77,31.79 C25.1 | C27.2 49.62,36.71 arc-45 49.56,36.57 C26.2 48.73,35.73 arc-45 48.58,35.67 47.95,35.67 | IMU2.15 47.55,34.67 arc90 47.75,34.88 47.75,35.47 | IMU2.18 47.55,36.17 arc-90 47.75,35.97 47.75,35.47 | 47.55,35.67 arc90 47.75,35.88 arc90 47.95,35.67 | 47.55,35.67 IMU2.17 | 47.75,35.47 arc90 47.55,35.67 | 47.75,35.47 arc-90 47.95,35.67 | IMU2.1 41.42,36.17 arc-90 v41.4,36.2
  Top 0.254: 56.93,26.45 arc45 56.9,26.37 PIC2.25 | PIC2.20 59.4,26.49 arc-45 C54.2 | PIC2.9 65.23,18.66 arc90 C53.2 | PIC2.41 47.99,18.16 arc45 47.81,18.09 47.36,17.64 arc-45 47.18,17.57 C52.2 | C27.2 v50.93,37.85 | C25.1 v48.51,30.48 | C24.2 41.57,32.42 arc45 v41.53,32.64 | C46.2 | C47.2 | U$3.5 arc-90 U$3.5
  Top 0.305: 56.9,26.37 arc45 56.81,26.59 C51.2
  Top 0.508: 59.4,26.49 59.4,27.95 arc-45 59.55,28.31 v59.56,28.32 | J19.1 v70.25,33.02 arc-90 v70.26,33.02 | 48.73,35.73 arc-90 C26.2 | DI3.4 59.69,60.28 arc45 59.84,59.92 60.39,59.37 arc-45 60.54,59.01 C28.2 v62.23,58.42 | v29.46,34.04 U$3.5 | C2.2 35.65,41.49 arc90 v35.69,41.53 | v24.64,29.34 arc45 24.69,29.22 XLED4.CAT | v39.43,10.16 R73.1
  Top 0.762: C57.2 C50.2 C63.- | 57.03,31.5 57.06,31.53 | 57.06,31.53 arc-45 57.6,31.75 v59.05,31.75 | 57.06,31.53 C58.2 | C53.2 C32.2 68.75,18.84 arc45 69.29,19.06 v69.98,19.75 | XBEE.10 2.63,28.7 arc90 3.4,27.94 C6.2
  Top 1.016: C57.2 63.99,7.41 arc-90 v64.11,7.29 | C52.2 C55.2 41.05,17.57 arc-90 v41.02,17.59 | 57.03,31.5 arc45 56.73,30.78 C56.2 C51.2 | C48.- 62.02,52.49 arc45 C46.2 | P4.1 55.42,48.98 arc45 56.13,48.68 C49.- 60.58,47.79 arc45 61.3,47.49 C47.2
  Top 1.27: C46.2 v64.52,52.58 | C47.2 v64.52,47.5
  Bottom 0.254: 33.41,41.53 33.4,41.53 arc90 33.66,41.78 33.66,41.91 | v29.46,34.04 arc90 29.21,34.42 29.21,34.29
  Bottom 0.508: v59.56,28.32 arc-45 59.65,28.54 59.69,28.57 | 39.37,10.22 arc90 v39.43,10.16 39.37,10.22 | 39.37,10.22 39.37,10.41 | v70.26,33.02 arc90 70.28,32.99 70.54,32.99 | 61.59,59.69 61.59,59.56 | v62.23,58.42 63.5,58.42 | 17.27,36.7 17.27,38.23 | 2.63,31.42 2.63,32.64 arc-90 3.14,33.15 7.49,33.15 | 17.78,33.15 arc90 18.16,33.53 arc45 18.05,33.79 17.86,33.98 | 7.49,33.15 arc-90 6.99,33.66 | 7.49,33.15 17.78,33.15 | 6.99,33.66 arc-90 6.48,33.15 | 6.99,33.66 J18.1 | v35.69,41.53 35.56,41.53 | 17.78,33.15 24.13,33.15 arc-90 24.64,32.64 | 24.64,32.64 v24.64,29.34 | 24.64,32.64 arc-90 25.15,33.15 27.05,33.15
  Bottom 0.762: v59.05,31.75 59.56,31.75 | v69.98,19.75 arc-45 70.08,19.7 70.23,19.56
  Bottom 1.016: v64.11,7.29 64.52,7.29 | v41.02,17.59 41.27,17.59 arc-90 41.21,17.65 | XBEE.10 2.63,31.42
  pour Bottom: 36.83,3.17 36.83,30.48 arc90 34.29,33.02 19.68,33.02 arc-90 17.14,35.56 17.14,50.8 arc-90 19.68,53.34 28.16,53.34 arc45 29.95,54.08 38.37,62.5 arc-45 40.17,63.25 73.66,63.25 arc-90 74.93,61.98 74.93,3.17 arc-90 73.66,1.91 38.1,1.91 arc-90
  pour Bottom (no thermals): 19.68,46.35 22.23,46.35 22.23,43.81 22.23,43.18 20.32,43.18 19.05,43.18 19.05,45.09 19.05,46.35
IMU_INT2  (via drill 0.6)
  Top 0.203: 47.75,33.02 46.28,33.02 arc90 IMU2.12
  Top 0.254: PIC2.35 49.81,21.16 arc-45 49.63,21.24 v49.02,21.84 | v48.9,25.4 50.85,27.36 arc45 50.93,27.54 50.93,32.77 arc90 50.67,33.02 47.75,33.02
  Bottom 0.254: v49.02,21.84 48.97,21.9 arc-45 48.9,22.08 v48.9,25.4
LED1
  Top 0.254: PIC2.43 48.9,17.16 arc90 48.64,16.91 48.64,7.11 arc-90 48.13,6.6 7.87,6.6 arc90 7.62,6.35 LED1.K
LED2
  Top 0.254: PIC2.44 49.4,16.66 arc90 49.15,16.41 49.15,6.6 arc-90 48.64,6.1 16.13,6.1 arc90 15.88,5.84 LED2.K
LED3
  Top 0.254: LED3.K 24.13,5.33 arc-90 24.38,5.59 49.15,5.59 arc90 49.66,6.1 49.66,15.91 arc-90 49.91,16.16 PIC2.45
LED4
  Top 0.254: PIC2.46 50.42,15.66 arc90 50.16,15.41 50.16,4.32 arc-90 49.66,3.81 LED4.K
LOW_MAG  (via drill 0.6)
  Top 0.254: v57.15,57.78 DI3.2 | v57.15,46.86 57.15,36.83 arc-90 56.9,36.58 v56.01,36.58 | v53.47,28.96 53.47,26.39 arc45 53.54,26.21 54.33,25.43 arc-45 54.4,25.25 PIC2.30
  Bottom 0.254: v57.15,46.86 v57.15,57.78 | v56.01,36.58 56.01,29.21 arc-90 55.75,28.96 v53.47,28.96
LOW_MAG_2
  Top 0.508: DI3.6 58.42,68.12 arc45 58.27,68.47 57.43,69.32 arc-45 57.28,69.68 57.28,71.56 arc-90 57.78,72.07 M2.G
LOW_MAGA
  Top 0.254: PIC2.23 57.9,29.97 arc-90 58.15,30.23 66.8,30.23 arc90 67.06,30.48 67.06,45.83 arc-90 67.31,46.09 J17.2
LOW_MAGB
  Top 0.254: PIC2.22 58.4,29.34 arc-90 58.65,29.59 68.33,29.59 arc90 68.58,29.84 J17.4
MCLR_2
  Top 0.203: R61.1 71.33,9.8 arc-90 71.13,9.6 RESET2.1
  Top 0.254: PIC2.7 67.69,17.66 arc-90 67.94,17.41 67.94,16.13 arc90 68.2,15.88 71.08,15.88 | 71.08,15.88 PROG_1.1 71.59,15.88 arc90 71.33,15.62 | R61.1 71.33,15.62 | 71.33,15.62 arc90 71.08,15.88
MOTA
  Top 0.254: PIC2.34 50.58,21.66 arc-45 50.4,21.74 49.48,22.66 arc45 49.3,22.73 32,22.73 arc-90 31.75,22.99 31.75,27.84 arc45 31.68,28.01 25.09,34.6 arc45 24.91,34.67 16.87,34.67 arc-45 16.69,34.74 13.14,38.3 arc45 12.96,38.37 J18.2
MOTB
  Top 0.254: PIC2.33 50.97,22.16 arc-45 50.79,22.24 49.86,23.17 arc45 49.68,23.24 32.64,23.24 arc-90 32.38,23.5 32.38,28.47 arc45 32.31,28.65 25.86,35.1 arc45 25.68,35.18 23.74,35.18 23.5,35.18 17.63,35.18 arc-45 17.45,35.25 10.41,42.3 arc45 10.23,42.37 J18.4
N$1
  Top 0.61: 64.63,70.48 arc45 64.2,70.31 D7.A
  Top 0.762: M2.D arc90 61.7,70.24 D7.A
  Top 1.27: J21.2 arc-90 67.43,70.24 D7.A
N$2
  Top 0.254: U$3.3 18.01,37.47 arc-45 17.83,37.54 9.85,45.52 arc-45 9.78,45.7 9.78,54.63 arc90 9.53,54.88 JP1.2
N$3
  Top 0.254: U$3.2 17.63,38.73 arc-45 17.45,38.81 10.49,45.77 arc-45 10.41,45.95 10.41,56.63 arc90 10.16,56.88 JP1.3
N$4
  Top 0.254: XBEE.13 6.63,11.82 arc90 R11.2
N$5
  Top 0.254: JP1.4 10.79,58.88 arc-90 11.05,58.63 11.05,46.21 arc45 11.12,46.03 17.07,40.08 arc45 17.25,40.01 U$3.1 23.78,40.09 arc-45 23.71,40.27
  Top 0.508: C1.1 arc-90 23.87,41.75 U$3.1
N$6  (via drill 0.6)
  Top 0.508: 55.32,66.25 arc90 55.83,66.76 | 55.32,66.25 55.33,66.25 arc-90 55.84,65.89 55.84,66.7 arc-90 DI3.8 | C31.1 55.32,66.25
  Top 0.762: v54.8,75.4 54.8,76.2 arc90 54.04,76.97 49.53,76.97 | v53.98,68.07 C31.1
  Top 1.016: P5.3 45.21,75.48 arc-45 45.92,75.78 C7.1 48.51,76.67 arc-45 49.23,76.97 49.53,76.97 C67.1
  Bottom 0.762: v54.8,75.4 54.8,68.9 arc-90 v53.98,68.07
N$9
  Top 0.254: XBEE.20 20.64,11.66 arc-90 R10.2
N$10
  Top 0.254: R10.1 arc-90 21.21,13.94 XLED1.AN
N$22
  Top 0.203: IMU2.20 45.71,37.5 arc-45 45.77,37.64 46.17,38.04 arc-45 46.31,38.1 47.72,38.1 arc-90 47.92,37.9 C27.1
N$24
  Top 0.203: IMU2.10 45.21,30.65 arc90 C25.2
N$27
  Top 0.254: R11.1 6.6,15.11 arc-90 7.37,15.88 16.19,15.88 arc45 16.73,16.1 XLED2.AN
N$30
  Top 0.254: XBEE.15 10.63,11.82 arc-90 R12.2
N$31
  Top 0.254: R12.1 10.67,14.44 arc-90 11.43,15.21 XLED3.AN
N$32  (via drill 0.6)
  Top 0.762: R13.2 v10.67,26.54
  Bottom 0.762: XBEE.6 10.63,26.58 arc90 v10.67,26.54
N$39
  Top 0.254: R13.1 21.19,23.41 arc45 21.73,23.63 XLED4.AN
N$50  (via drill 0.6)
  Top 0.254: JP1.1 8.89,52.88 arc-90 9.14,52.63 9.14,45.44 arc45 9.22,45.27 18.21,36.27 arc45 18.39,36.2 v20.32,36.2 U$3.4
  Top 0.508: v20.32,41.91 C1.2
  Bottom 0.508: v20.32,36.2 v20.32,41.91
N$104
  Top 0.254: PIC2.56 56.9,9.36 arc90 C63.+
N$108
  Top 0.254: R66.2 2.05,3.88 arc45 2.23,3.81 LED1.A
N$109
  Top 0.254: R67.2 10.3,3.88 arc45 10.48,3.81 LED2.A
N$110
  Top 0.254: R68.2 18.56,3.88 arc45 18.73,3.81 LED3.A
N$111
  Top 0.254: R69.2 26.81,3.88 arc45 26.99,3.81 LED4.A
N$112
  Top 0.508: J19.2 71.25,30.61 arc90 71.75,31.12 71.75,33.95 arc-45 71.9,34.31 72.46,34.86 arc45 72.61,35.22 R70.2
PGEC1_2
  Top 0.254: PIC2.17 72.91,24.11 arc45 73.08,24.19 PROG_1.5
PGED1_2
  Top 0.254: PROG_1.4 62.34,23.5 arc45 62.16,23.42 61.29,22.55 arc-45 61.11,22.48 60.65,22.48 arc-90 60.4,22.73 PIC2.18
PRE3.3  (via drill 0.6)
  Top 0.254: 48.51,50.04 arc90 48.64,50.16 arc90 48.92,50.44 P4.4
  Top 0.508: DI3.1 55.88,62.99 arc-90 56.39,63.5 57.91,63.5 arc-90 58.42,62.99 DI3.3 58.42,59.05 arc45 58.57,58.69 C28.1 58.84,57.53 arc90 59.35,57.02 v66.55,57.02 | v66.55,54.23 66.55,50.8 arc-90 66.04,50.3 C47.1
  Top 1.016: P4.2 56.32,51.46 arc-45 57.04,51.16 57.53,50.68 arc45 58.24,50.38 C49.+ 62.02,50.38 arc-45 C47.1
  Top 1.27: SW1.2 SW1.5
  Top 1.524: P4.4 arc-45 48.98,51.46 P4.2 53.59,51.46 arc90 52.07,49.94 | 52.07,49.94 arc90 50.55,51.46 | SW1.5 52.07,49.94
  Bottom 0.508: v66.55,54.23 v66.55,57.02
SCL1  (via drill 0.6)
  Top 0.203: 44.41,41.04 arc90 44.21,40.83 | 44.21,41.24 arc90 44.41,41.04 | 44.41,41.04 45.02,41.04 | 44.21,41.24 IMU2.23 | 43.69,42.29 44.01,42.29 arc-90 44.21,42.09 44.21,41.24
  Top 0.254: 45.02,41.04 R2.1 | 43.69,42.29 41.51,42.29 arc45 41.33,42.22 37.54,38.43 arc45 37.47,38.25 J1.1 | PIC2.37 47.88,20.16 arc-45 47.71,20.24 v47.24,20.7
  Bottom 0.254: v47.24,20.7 47.24,27.69 arc90 46.99,27.94 37.84,27.94 arc45 37.66,27.87 J1.1
SCL2
  Top 0.254: PIC2.31 53.9,23.11 arc-90 53.65,22.86 52.81,22.86 arc-45 52.63,22.93 51.89,23.68 arc45 51.71,23.75 33.27,23.75 arc-90 33.02,24 33.02,37.16 arc90 32.7,37.48 R4.1
  Top 0.508: U$3.6 31.71,37.47 arc45 R4.1
SDA1  (via drill 0.6)
  Top 0.203: 43.51,41.04 arc-90 43.71,40.83 | 43.71,41.24 arc-90 43.51,41.04 | 43.51,41.04 R1.1 | 43.71,41.24 IMU2.24 | 42.55,41.78 43.51,41.78 arc-90 43.71,41.58 43.71,41.24
  Top 0.254: 42.55,41.78 41.89,41.78 arc45 41.71,41.71 38.81,38.81 arc45 38.73,38.63 38.73,27.03 arc-45 38.66,26.85 37.47,25.65 J1.2 | PIC2.36 48.91,20.66 arc-45 48.73,20.74 47.83,21.64 arc45 47.65,21.72 v45.85,21.72
  Bottom 0.254: v45.85,21.72 45.85,26.42 arc90 45.59,26.67 38.57,26.67 arc45 38.39,26.6 J1.2
SDA2
  Top 0.254: 53.38,23.99 arc90 53.12,24.24 arc90 53.38,24.5 arc-90 53.4,24.47 PIC2.32 53.37,24.14 arc45 53.12,24.24 33.91,24.24 arc-90 33.66,24.5 33.66,38.53 arc90 33.34,38.85 31.88,38.85 arc90 R3.1
  Top 0.508: U$3.7 31.71,38.73 arc-45 R3.1
USER
  Top 0.254: PIC2.42 48.5,17.66 arc45 48.33,17.59 45.87,15.13 arc45 45.8,14.96 USER.2
  Top 0.508: R73.2 43.4,13.46 arc-90 43.9,13.97 USER.2

### Text on the board
tPlace: Magnet | Control | SOT | 24V | 23F | 1B | ES | 2937 | GND | .1uF | .1uF | 10uF | SI8410 | BB-D-IS | .1uF | 3.3V | SCL | GND | SDA | GND | 1117 | - | CC10-2405SF-E | A | 10uF | B | .1uF | .1uF | + | Gyro | Bottom | Magnet | + | ISO1540 | Accel | Mag | B | A | .1uF | 2.2nF | X | X | Y | Y | Motor | - | Z | Z | DNI | 9150 | MPU | 3 LEDs | .1uF | 10uF | GND | 10nF | .1uF | .1uF | 5V | RSSI | MPU | SLEEP | SCL | .01uF | .1uF | SDA | I2C | 9150 | .01uF | .1uF | .1uF | .01uF | XBee | ASSOC | 2.2k | ON/OFF | USER | 2.2k | 10uF | .01uF | .1uF | 1 | 2 | 3 | 4 | RESET | GND | 1k | 1k | 1k | 1k